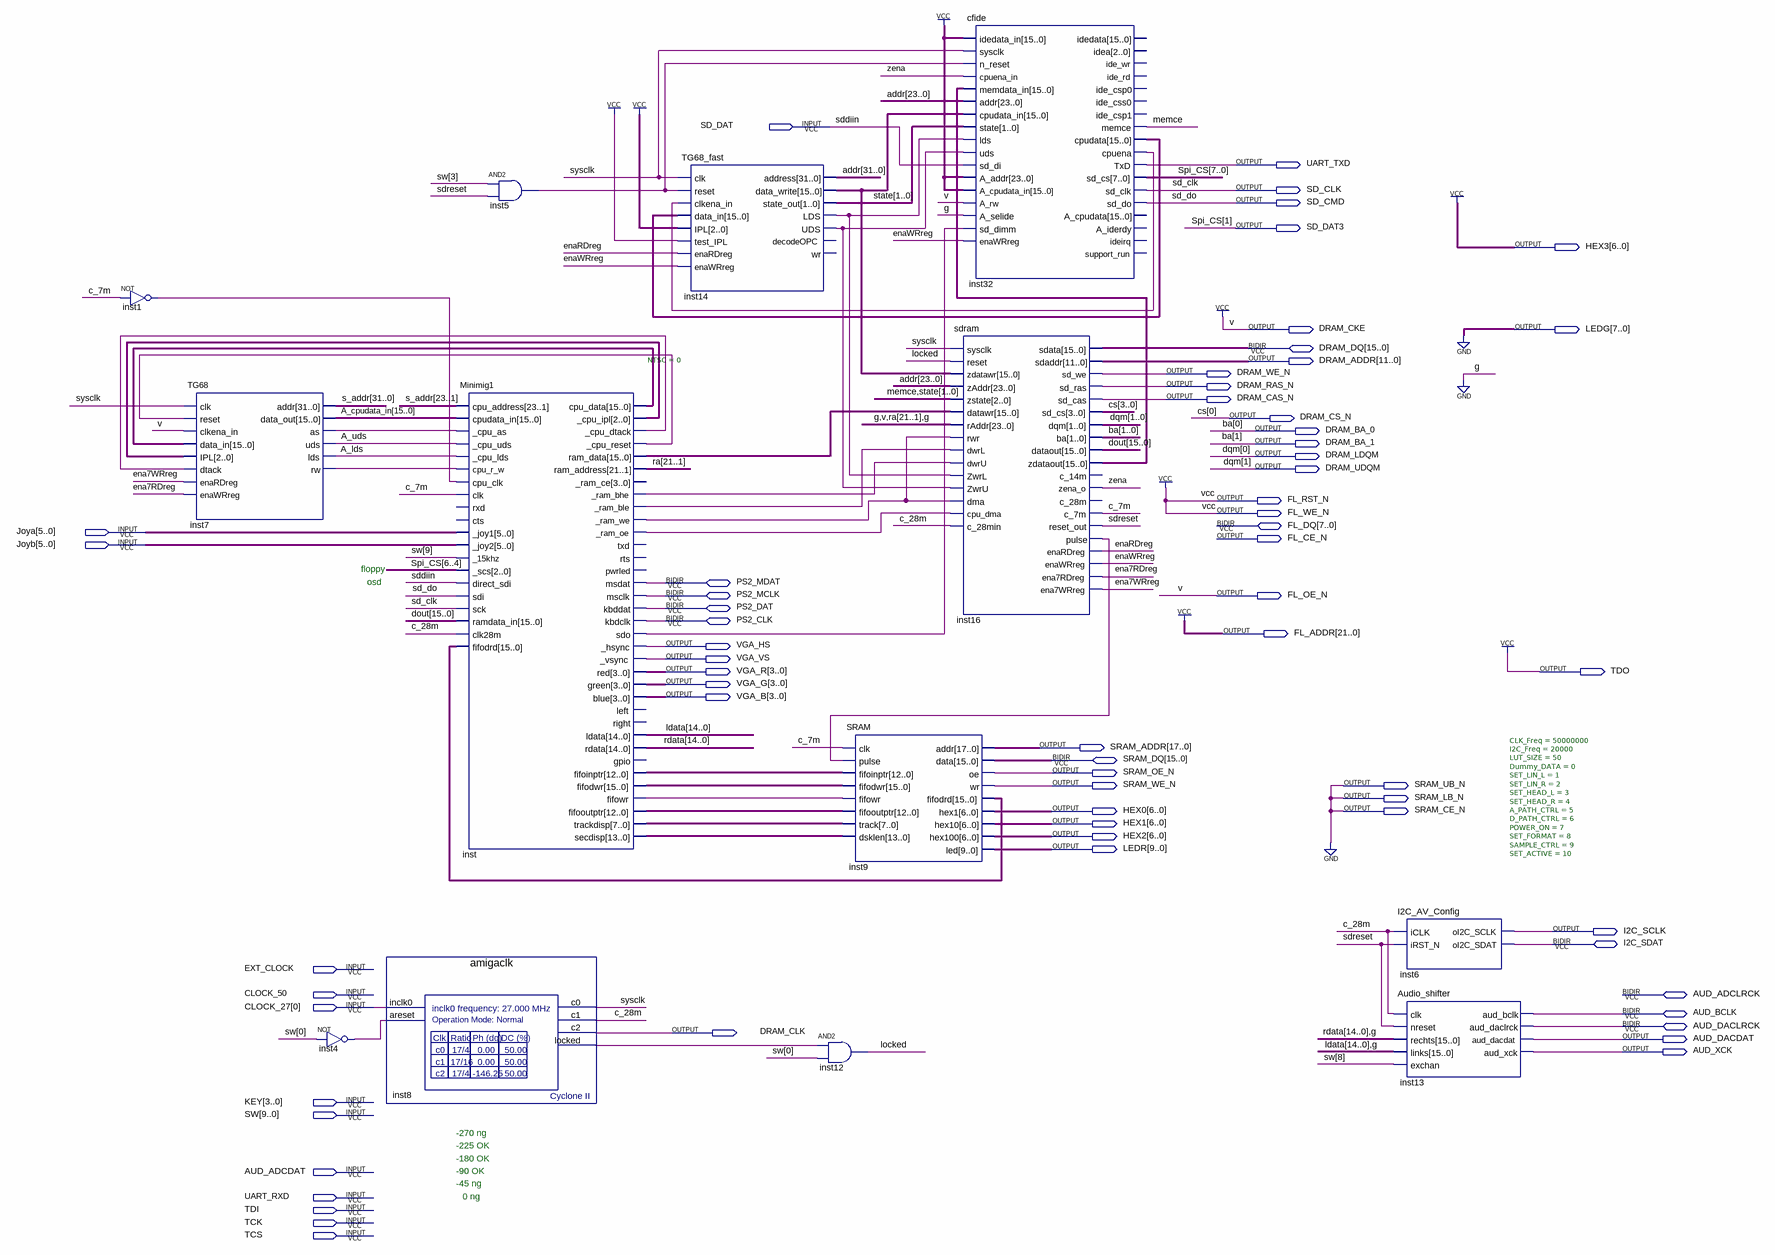
[diagram p0: schematic sheet]
// Quartus schematic minimig_de1.bdf as structural Verilog: 13 symbols, 65 pins
module minimig_de1 (
  input  SD_DAT,
  input  [5:0] Joya,
  input  [5:0] Joyb,
  input  EXT_CLOCK,
  input  CLOCK_50,
  input  [0:0] CLOCK_27,
  input  [3:0] KEY,
  input  [9:0] SW,
  input  AUD_ADCDAT,
  input  UART_RXD,
  input  TDI,
  input  TCK,
  input  TCS,
  inout  [15:0] DRAM_DQ,
  inout  [7:0] FL_DQ,
  inout  PS2_MDAT,
  inout  PS2_MCLK,
  inout  PS2_DAT,
  inout  PS2_CLK,
  inout  [15:0] SRAM_DQ,
  inout  I2C_SDAT,
  inout  AUD_ADCLRCK,
  inout  AUD_BCLK,
  inout  AUD_DACLRCK,
  output UART_TXD,
  output SD_CLK,
  output SD_CMD,
  output SD_DAT3,
  output [6:0] HEX3,
  output DRAM_CKE,
  output [7:0] LEDG,
  output [11:0] DRAM_ADDR,
  output DRAM_WE_N,
  output DRAM_RAS_N,
  output DRAM_CAS_N,
  output DRAM_CS_N,
  output DRAM_BA_0,
  output DRAM_BA_1,
  output DRAM_LDQM,
  output DRAM_UDQM,
  output FL_RST_N,
  output FL_WE_N,
  output FL_CE_N,
  output FL_OE_N,
  output [21:0] FL_ADDR,
  output VGA_HS,
  output VGA_VS,
  output [3:0] VGA_R,
  output TDO,
  output [3:0] VGA_G,
  output [3:0] VGA_B,
  output [17:0] SRAM_ADDR,
  output SRAM_OE_N,
  output SRAM_WE_N,
  output SRAM_UB_N,
  output SRAM_LB_N,
  output [6:0] HEX0,
  output SRAM_CE_N,
  output [6:0] HEX1,
  output [6:0] HEX2,
  output [9:0] LEDR,
  output I2C_SCLK,
  output DRAM_CLK,
  output AUD_DACDAT,
  output AUD_XCK
);

  wire A_lds, A_uds, c_7m, c_28m, ena7RDreg, ena7WRreg, enaRDreg, enaWRreg, inst1_out, inst4_out, inst5_out,
       inst7_as, inst7_rw, inst8_locked, inst14_lds, inst14_uds, inst16_pulse, inst32_cpuena,
       inst__cpu_dtack, inst__cpu_reset, inst__ram_bhe, inst__ram_ble, inst__ram_oe, inst__ram_we,
       inst_fifowr, inst_sdo, locked, memce, sdreset, sysclk, zena;
  wire [1:0] state;
  wire [2:0] inst__cpu_ipl;
  wire [3:1] cs;
  wire [7:0] inst_trackdisp, Spi_CS;
  wire [12:0] inst_fifoinptr, inst_fifooutptr;
  wire [13:0] inst_secdisp;
  wire [14:0] ldata, rdata;
  wire [15:0] A_cpudata_in, dout, inst9_fifodrd, inst14_data_write, inst16_zdataout, inst32_cpudata,
       inst_cpu_data, inst_fifodwr, inst_ram_data;
  wire [21:1] ra;
  wire [31:0] addr, s_addr;

  not inst1 (inst1_out, c_7m);
  TG68 inst7 (
    .clk(sysclk), .reset(inst__cpu_reset), .clkena_in(1'b1), .data_in(inst_cpu_data), .IPL(inst__cpu_ipl),
    .dtack(inst__cpu_dtack), .enaRDreg(ena7WRreg), .enaWRreg(ena7RDreg), .addr(s_addr),
    .data_out(A_cpudata_in), .as(inst7_as), .uds(A_uds), .lds(A_lds), .rw(inst7_rw));
  not inst4 (inst4_out, SW[0]);
  amigaclk inst8 (
    .inclk0(CLOCK_27[0]), .areset(inst4_out), .c0(sysclk), .c1(c_28m), .c2(DRAM_CLK), .locked(inst8_locked));
  Minimig1 #(.NTSC(0)) inst (
    .cpu_address(s_addr[23:1]), .cpudata_in(A_cpudata_in), ._cpu_as(inst7_as), ._cpu_uds(A_uds),
    ._cpu_lds(A_lds), .cpu_r_w(inst7_rw), .cpu_clk(inst1_out), .clk(c_7m), ._joy1(Joya), ._joy2(Joyb),
    ._15khz(SW[9]), ._scs(Spi_CS[6:4]), .direct_sdi(SD_DAT), .sdi(SD_CMD), .sck(SD_CLK), .ramdata_in(dout),
    .clk28m(c_28m), .fifodrd(inst9_fifodrd), .cpu_data(inst_cpu_data), ._cpu_ipl(inst__cpu_ipl),
    ._cpu_dtack(inst__cpu_dtack), ._cpu_reset(inst__cpu_reset), .ram_address(ra), ._ram_bhe(inst__ram_bhe),
    ._ram_ble(inst__ram_ble), ._ram_we(inst__ram_we), ._ram_oe(inst__ram_oe), ._hsync(VGA_HS),
    ._vsync(VGA_VS), .red(VGA_R), .green(VGA_G), .blue(VGA_B), .ldata(ldata), .rdata(rdata),
    .fifoinptr(inst_fifoinptr), .fifodwr(inst_fifodwr), .fifowr(inst_fifowr), .fifooutptr(inst_fifooutptr),
    .trackdisp(inst_trackdisp), .secdisp(inst_secdisp), .ram_data(inst_ram_data), .msdat(PS2_MDAT),
    .msclk(PS2_MCLK), .kbddat(PS2_DAT), .kbdclk(PS2_CLK), .sdo(inst_sdo));  // open: rxd, cts, _ram_ce, txd, rts, pwrled, left, right, gpio
  and inst5 (inst5_out, SW[3], sdreset);
  TG68_fast inst14 (
    .clk(sysclk), .reset(inst5_out), .clkena_in(inst32_cpuena), .data_in(inst32_cpudata), .IPL(3'b111),
    .test_IPL(1'b1), .enaRDreg(enaRDreg), .enaWRreg(enaWRreg), .address(addr),
    .data_write(inst14_data_write), .state_out(state), .LDS(inst14_lds), .UDS(inst14_uds));  // open: decodeOPC, wr
  and inst12 (locked, inst8_locked, SW[0]);
  SRAM inst9 (
    .clk(c_7m), .pulse(inst16_pulse), .fifoinptr(inst_fifoinptr), .fifodwr(inst_fifodwr),
    .fifowr(inst_fifowr), .fifooutptr(inst_fifooutptr), .track(inst_trackdisp), .dsklen(inst_secdisp),
    .addr(SRAM_ADDR), .oe(SRAM_OE_N), .wr(SRAM_WE_N), .fifodrd(inst9_fifodrd), .hex1(HEX0), .hex10(HEX1),
    .hex100(HEX2), .led(LEDR), .data(SRAM_DQ));
  cfide inst32 (
    .idedata_in({24{1'b1}}), .sysclk(sysclk), .n_reset(inst5_out), .cpuena_in(zena),
    .memdata_in(inst16_zdataout), .addr(addr[23:0]), .cpudata_in(inst14_data_write), .state(state),
    .lds(inst14_lds), .uds(inst14_uds), .sd_di(SD_DAT), .A_addr({24{1'b1}}), .A_cpudata_in({24{1'b1}}),
    .A_rw(1'b1), .A_selide(1'b0), .sd_dimm(inst_sdo), .enaWRreg(enaWRreg), .memce(memce),
    .cpudata(inst32_cpudata), .cpuena(inst32_cpuena), .TxD(UART_TXD),
    .sd_cs({Spi_CS[7:2], SD_DAT3, Spi_CS[0]}), .sd_clk(SD_CLK), .sd_do(SD_CMD));  // open: idedata, idea, ide_wr, ide_rd, ide_csp0, ide_css0, ide_csp1, A_cpudata, A_iderdy, ideirq, support_run
  sdram inst16 (
    .sysclk(sysclk), .reset(locked), .zdatawr(inst14_data_write), .zAddr(addr[23:0]),
    .zstate({memce, state}), .datawr(inst_ram_data), .rAddr({2'b01, ra, 1'b0}), .rwr(inst__ram_we),
    .dwrL(inst__ram_ble), .dwrU(inst__ram_bhe), .ZwrL(inst14_lds), .ZwrU(inst14_uds), .dma(inst__ram_we),
    .cpu_dma(inst__ram_oe), .c_28min(c_28m), .sdaddr(DRAM_ADDR), .sd_we(DRAM_WE_N), .sd_ras(DRAM_RAS_N),
    .sd_cas(DRAM_CAS_N), .sd_cs({cs, DRAM_CS_N}), .dqm({DRAM_UDQM, DRAM_LDQM}), .ba({DRAM_BA_1, DRAM_BA_0}),
    .dataout(dout), .zdataout(inst16_zdataout), .zena_o(zena), .c_7m(c_7m), .reset_out(sdreset),
    .pulse(inst16_pulse), .enaRDreg(enaRDreg), .enaWRreg(enaWRreg), .ena7RDreg(ena7RDreg),
    .ena7WRreg(ena7WRreg), .sdata(DRAM_DQ));  // open: c_14m, c_28m
  I2C_AV_Config #(.CLK_Freq(50000000), .I2C_Freq(20000), .LUT_SIZE(50), .Dummy_DATA(0), .SET_LIN_L(1), .SET_LIN_R(2), .SET_HEAD_L(3), .SET_HEAD_R(4), .A_PATH_CTRL(5), .D_PATH_CTRL(6), .POWER_ON(7), .SET_FORMAT(8), .SAMPLE_CTRL(9), .SET_ACTIVE(10)) inst6 (
    .iCLK(c_28m), .iRST_N(sdreset), .oI2C_SCLK(I2C_SCLK), .oI2C_SDAT(I2C_SDAT));
  Audio_shifter inst13 (
    .clk(c_28m), .nreset(sdreset), .rechts({rdata, 1'b0}), .links({ldata, 1'b0}), .exchan(SW[8]),
    .aud_bclk(AUD_BCLK), .aud_daclrck(AUD_DACLRCK), .aud_dacdat(AUD_DACDAT), .aud_xck(AUD_XCK));

  assign DRAM_CKE = 1'b1;
  assign FL_ADDR = {22{1'b1}};
  assign FL_OE_N = 1'b1;
  assign FL_RST_N = 1'b1;
  assign FL_WE_N = 1'b1;
  assign HEX3 = {7{1'b1}};
  assign LEDG = {8{1'b0}};
  assign SRAM_CE_N = 1'b0;
  assign SRAM_LB_N = 1'b0;
  assign SRAM_UB_N = 1'b0;
  assign TDO = 1'b1;

  // Other names for the same wires on the sheet: ba[1:0] = {DRAM_BA_1, DRAM_BA_0}; cs[0] = DRAM_CS_N;
  //   dqm[1:0] = {DRAM_UDQM, DRAM_LDQM}; sd_do = SD_CMD; sddiin = SD_DAT; Spi_CS[1] = SD_DAT3

  // Notes on the sheet:
  //   floppy
  //   osd
  //   -270 ng
  //   -225 OK
  //   -180 OK
  //   -90 OK
  //   -45 ng
  //   0 ng
endmodule
